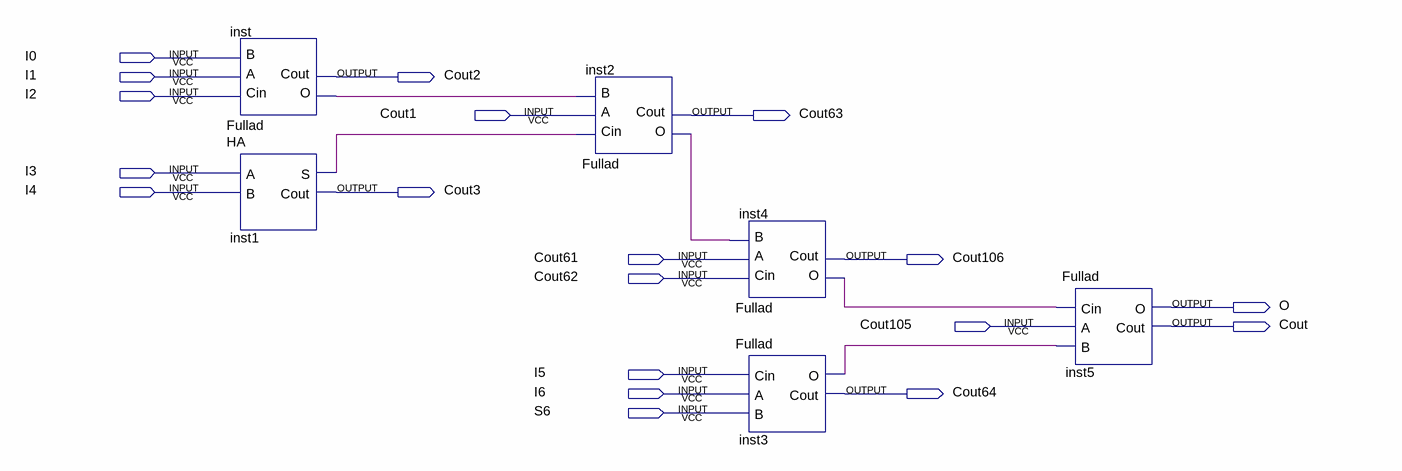
[diagram p0: schematic sheet]
// Quartus schematic B12.bdf as structural Verilog: 6 symbols, 19 pins
module B12 (
  input  I0,
  input  I1,
  input  I2,
  input  Cout1,
  input  I3,
  input  I4,
  input  Cout61,
  input  Cout62,
  input  Cout105,
  input  I5,
  input  I6,
  input  S6,
  output Cout2,
  output Cout63,
  output Cout3,
  output Cout106,
  output O,
  output Cout,
  output Cout64
);

  wire inst1_s, inst2_o, inst3_o, inst4_o, inst_o;

  Fullad inst (.Cin(I2), .A(I1), .B(I0), .O(inst_o), .Cout(Cout2));
  HA inst1 (.A(I3), .B(I4), .S(inst1_s), .Cout(Cout3));
  Fullad inst2 (.Cin(inst1_s), .A(Cout1), .B(inst_o), .O(inst2_o), .Cout(Cout63));
  Fullad inst4 (.Cin(Cout62), .A(Cout61), .B(inst2_o), .O(inst4_o), .Cout(Cout106));
  Fullad inst3 (.Cin(I5), .A(I6), .B(S6), .O(inst3_o), .Cout(Cout64));
  Fullad inst5 (.Cin(inst4_o), .A(Cout105), .B(inst3_o), .O(O), .Cout(Cout));
endmodule
